# EAGLE design GBWand (EAGLE 9.6.2)
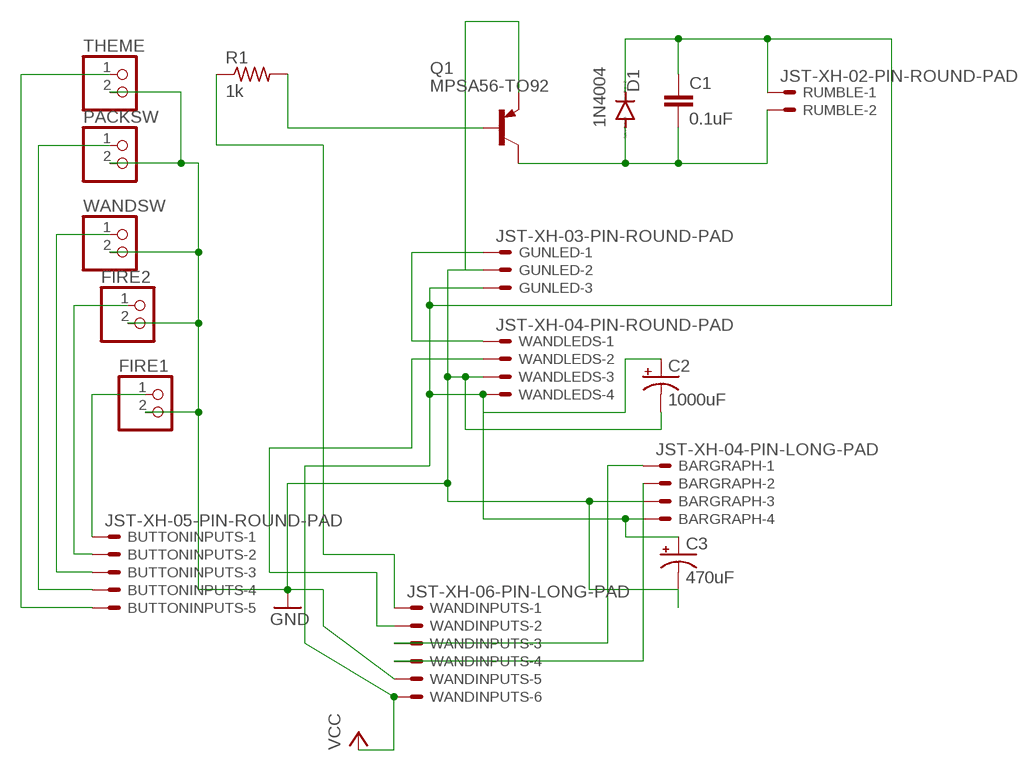
[diagram p0: schematic, sheet 1]

## Parts
BARGRAPH  JST-XH-04-PIN-LONG-PAD  [JST-XH-04-PACKAGE-LONG-PAD]
BUTTONINPUTS  JST-XH-05-PIN-ROUND-PAD  [JST-XH-05-PACKAGE-ROUND-PAD]
C1  0.1uF  C-EU050-024X044  [C050-024X044]
C2  1000uF  CPOL-USE2.5-6  [E2,5-6]
C3  470uF  CPOL-USE2.5-6  [E2,5-6]
D1  1N4004  [DO41-10]
FIRE1  PINHD-1X2  [1X02]
FIRE2  PINHD-1X2  [1X02]
GUNLED  JST-XH-03-PIN-ROUND-PAD  [JST-XH-03-PACKAGE-ROUND-PAD]
PACKSW  PINHD-1X2  [1X02]
Q1  MPSA56-TO92  [TO92-CBE]
R1  1k  R-US_0207/9  [0207/9]
RUMBLE  JST-XH-02-PIN-ROUND-PAD  [JST-XH-02-PACKAGE-ROUND-PAD]
THEME  PINHD-1X2  [1X02]
WANDINPUTS  JST-XH-06-PIN-LONG-PAD  [JST-XH-06-PACKAGE-LONG-PAD]
WANDLEDS  JST-XH-04-PIN-ROUND-PAD  [JST-XH-04-PACKAGE-ROUND-PAD]
WANDSW  PINHD-1X2  [1X02]

## Nets
GND: BARGRAPH.3 C2.- C3.- FIRE1.2 FIRE2.2 GUNLED.2 PACKSW.2 Q1.E THEME.2 WANDINPUTS.5 WANDLEDS.3 WANDSW.2
N$1: WANDINPUTS.2 WANDLEDS.2
N$2: BUTTONINPUTS.1 FIRE1.1
N$3: BUTTONINPUTS.2 FIRE2.1
N$4: BUTTONINPUTS.3 WANDSW.1
N$5: BUTTONINPUTS.4 PACKSW.1
N$6: BUTTONINPUTS.5 THEME.1
N$7: GUNLED.1 WANDLEDS.1
N$9: R1.1 WANDINPUTS.1
N$10: Q1.B R1.2
N$13: BARGRAPH.2 WANDINPUTS.4
N$14: BARGRAPH.1 WANDINPUTS.3
N$15: C1.2 D1.A Q1.C RUMBLE.2
VCC: BARGRAPH.4 C1.1 C2.+ C3.+ D1.C GUNLED.3 RUMBLE.1 WANDINPUTS.6 WANDLEDS.4

## Library data of the parts
BARGRAPH WANDLEDS = Rembrandt Electronics - JST XH Connectors v1-0:JST-XH-04-PIN: JST XH Connector 2 Pin Wire to board connector. Pitch: 2,54 mm, (0.100") Number of pins: 4 Created by Rembrandt Electronics www.rembrandtelectronics.com
BUTTONINPUTS = Rembrandt Electronics - JST XH Connectors v1-0:JST-XH-05-PIN: JST XH Connector 2 Pin Wire to board connector. Pitch: 2,54 mm, (0.100") Number of pins: 5 Created by Rembrandt Electronics www.rembrandtelectronics.com
C1 = rcl:C-EU: CAPACITOR, European symbol; SPICEPREFIX: C
C2 C3 = rcl:CPOL-US: POLARIZED CAPACITOR, American symbol; SPICEPREFIX: C
D1 = diode:1N4004: DIODE general purpose rectifier, 1 A
FIRE1 FIRE2 PACKSW THEME WANDSW = pinhead:PINHD-1X2: PIN HEADER
GUNLED = Rembrandt Electronics - JST XH Connectors v1-0:JST-XH-03-PIN: JST XH Connector 2 Pin Wire to board connector. Pitch: 2,54 mm, (0.100") Number of pins: 3 Created by Rembrandt Electronics www.rembrandtelectronics.com
Q1 = transistor-pnp:*-?: PNP Transistor
R1 = adafruit:R-US_: RESISTOR, American symbol
RUMBLE = Rembrandt Electronics - JST XH Connectors v1-0:JST-XH-02-PIN: JST XH Connector 2 Pin Wire to board connector. Pitch: 2,54 mm, (0.100") Number of pins: 2 Created by Rembrandt Electronics www.rembrandtelectronics.com
WANDINPUTS = Rembrandt Electronics - JST XH Connectors v1-0:JST-XH-06-PIN: JST XH Connector 2 Pin Wire to board connector. Pitch: 2,54 mm, (0.100") Number of pins: 6 Created by Rembrandt Electronics www.rembrandtelectronics.com

## Board
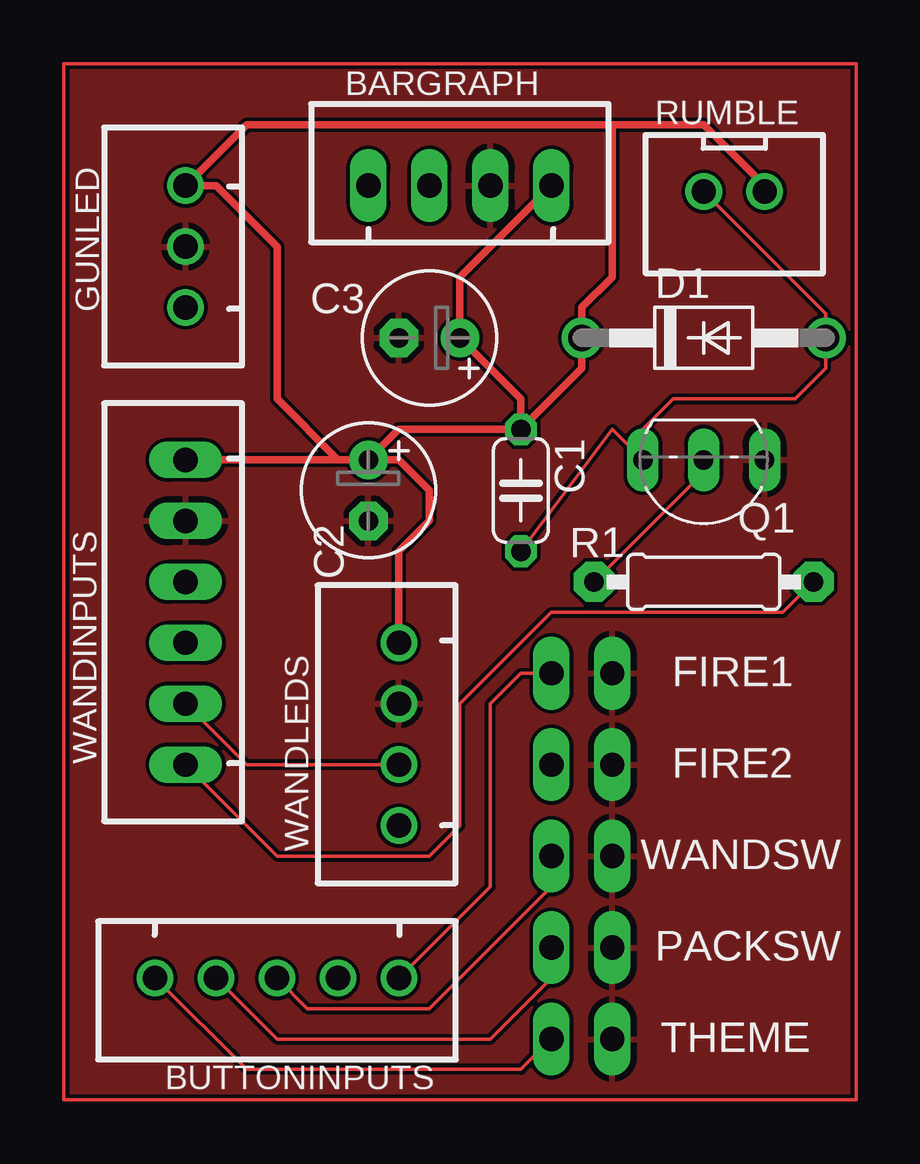
[diagram p1: board, top side]
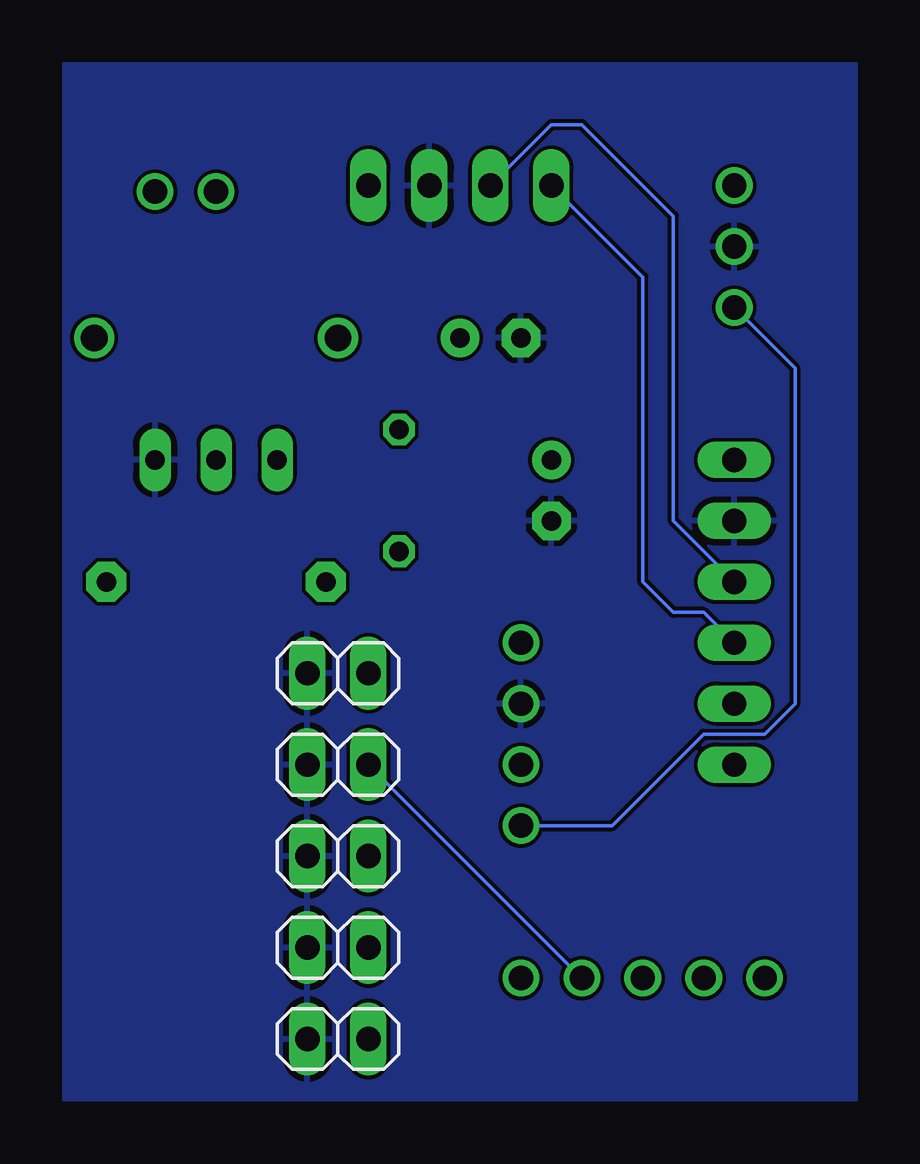
[diagram p2: board, bottom side, seen from below]

No outline drawn. Coordinates in mm, seen from the top.
Copper layers (1*16): Top 0.035mm / dielectric 1.5mm / Bottom 0.035mm
Design rules "default": minimum track width 6mil, minimum drill 0.35mm, track to track 6mil, track to pad 6mil, pad to pad 6mil, via to via 6mil, smd to smd 6mil, copper to edge 40mil, drill to drill 6mil, minimum pad ring 10mil, minimum via ring 8mil, stop-mask expansion 4mil, vias tented up to drill 0mil, thermal gap 10mil

### Footprints (pad centres in the part's own frame; a part is rotated, then mirrored left to right if it is on the bottom)
JST-XH-04-PACKAGE-LONG-PAD = drill 1.016 long: 1 -3.81,0; 2 -1.27,0; 3 1.27,0; 4 3.81,0
JST-XH-05-PACKAGE-ROUND-PAD = drill 1.016: 1 -5.08,0; 2 -2.54,0; 3 0,0; 4 2.54,0; 5 5.08,0
C050-024X044 = drill 0.813 octagon: 1 -2.54,0; 2 2.54,0
E2,5-6 = drill 0.813 pad 1.6: + -1.27,0 | drill 0.813 pad 1.6 octagon: - 1.27,0
DO41-10 = drill 1.118: A 5.08,0; C -5.08,0
1X02 = drill 1.016 long: 1 -1.27,0; 2 1.27,0
JST-XH-03-PACKAGE-ROUND-PAD = drill 1.016: 1 -2.54,0; 2 0,0; 3 2.54,0
TO92-CBE = drill 0.813 long: B 0,0; C 2.54,0; E -2.54,0
0207/9 = drill 0.813 pad 1.676 octagon: 1 -4.572,0; 2 4.572,0
JST-XH-02-PACKAGE-ROUND-PAD = drill 1.016: 1 -1.27,0; 2 1.27,0
JST-XH-06-PACKAGE-LONG-PAD = drill 1.016 long: 1 -6.35,0; 2 -3.81,0; 3 -1.27,0; 4 1.27,0; 5 3.81,0; 6 6.35,0
JST-XH-04-PACKAGE-ROUND-PAD = drill 1.016: 1 -3.81,0; 2 -1.27,0; 3 1.27,0; 4 3.81,0

### Placement (x,y rotation side)
BARGRAPH  20.32,62.23 0 top
BUTTONINPUTS  12.7,29.21 180 top
C1  22.86,49.53 270 top
C2  16.51,49.53 270 top
C3  19.05,55.88 180 top
D1  30.48,55.88 0 top
FIRE1  25.4,41.91 180 bottom
FIRE2  25.4,38.1 180 bottom
GUNLED  8.89,59.69 90 top
PACKSW  25.4,30.48 180 bottom
Q1  30.48,50.8 180 top
R1  30.48,45.72 180 top
RUMBLE  31.75,61.98 180 top
THEME  25.4,26.67 180 bottom
WANDINPUTS  8.89,44.45 90 top
WANDLEDS  17.78,39.37 90 top
WANDSW  25.4,34.29 180 bottom

### Tracks (layer width: path | path; a pad name or v marks a point on that pad's centre or on a via)
GND
  pour Top: 3.81,67.31 36.83,67.31 36.83,24.13 3.81,24.13
  pour Bottom: 3.81,67.31 36.83,67.31 36.83,24.13 3.81,24.13
N$1
  Top 0.152: WANDLEDS.2 11.43,38.1 WANDINPUTS.2
N$2
  Top 0.152: BUTTONINPUTS.1 21.59,33.02 21.59,40.64 22.86,41.91 FIRE1.1
N$3
  Bottom 0.152: BUTTONINPUTS.2 FIRE2.1
N$4
  Top 0.152: BUTTONINPUTS.3 13.97,27.94 19.05,27.94 24.13,33.02 WANDSW.1
N$5
  Top 0.152: BUTTONINPUTS.4 12.7,26.67 21.59,26.67 24.13,29.21 PACKSW.1
N$6
  Top 0.152: BUTTONINPUTS.5 11.43,25.4 22.86,25.4 THEME.1
N$7
  Bottom 0.152: WANDLEDS.1 13.97,35.56 10.16,39.37 7.62,39.37 6.35,40.64 6.35,54.61 GUNLED.1
N$9
  Top 0.152: WANDINPUTS.1 12.7,34.29 19.05,34.29 20.32,35.56 20.32,40.64 24.13,44.45 33.78,44.45 R1.1
N$10
  Top 0.152: R1.2 30.48,50.29 Q1.B
N$13
  Bottom 0.152: WANDINPUTS.4 11.43,48.26 11.43,60.96 15.24,64.77 16.51,64.77 BARGRAPH.2
N$14
  Bottom 0.152: WANDINPUTS.3 10.16,44.45 11.43,44.45 12.7,45.72 12.7,58.42 BARGRAPH.1
N$15
  Top 0.152: C1.2 26.67,52.07 Q1.C 27.94,52.07 29.21,53.34 34.29,53.34 35.56,54.61 D1.A 35.56,56.9 RUMBLE.2
S$1
  Top 0.152: 3.81,24.13 36.83,24.13 36.83,67.31 3.81,67.31 3.81,24.13
VCC
  Top 0.305: WANDINPUTS.6 C2.+ | RUMBLE.1 33.02,62.23 30.48,64.77 26.67,64.77 | 26.67,64.77 11.43,64.77 GUNLED.3 10.16,62.23 12.7,59.69 12.7,53.34 15.24,50.8 C2.+ | 26.67,64.77 26.67,58.42 25.4,57.15 D1.C 25.4,54.61 C1.1 | BARGRAPH.4 20.32,58.42 C3.+ 22.86,53.34 C1.1 | WANDLEDS.4 17.78,46.99 19.05,48.26 19.05,49.53 17.78,50.8 C2.+ | C2.+ 17.78,52.07 C1.1
  Bottom 0.152: 8.99,62.18 GUNLED.3